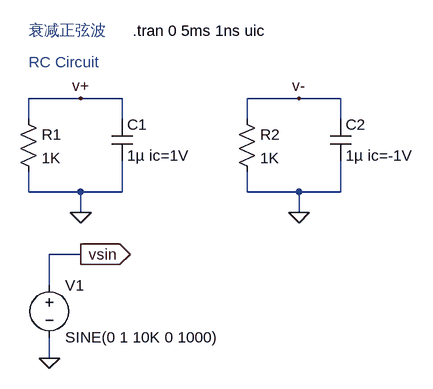
[diagram p0: schematic 04_DecadedSINWave.asc]
04_DecadedSINWave.asc, the LTspice schematic file:
Version 4
SHEET 1 880 680
WIRE 96 144 16 144
WIRE 160 144 96 144
WIRE 432 144 352 144
WIRE 496 144 432 144
WIRE 16 176 16 144
WIRE 160 176 160 144
WIRE 352 176 352 144
WIRE 496 176 496 144
WIRE 16 288 16 256
WIRE 96 288 16 288
WIRE 160 288 160 240
WIRE 160 288 96 288
WIRE 352 288 352 256
WIRE 432 288 352 288
WIRE 496 288 496 240
WIRE 496 288 432 288
WIRE 96 320 96 288
WIRE 432 320 432 288
WIRE 96 384 48 384
WIRE 48 432 48 384
WIRE 48 544 48 512
FLAG 96 320 0
FLAG 96 144 v+
FLAG 432 144 v-
FLAG 432 320 0
FLAG 48 544 0
FLAG 96 384 vsin
IOPIN 96 384 Out
SYMBOL Cap 144 176 R0
SYMATTR InstName C1
SYMATTR Value 1µ ic=1V
SYMBOL Res 0 160 R0
SYMATTR InstName R1
SYMATTR Value 1K
SYMBOL Cap 480 176 R0
SYMATTR InstName C2
SYMATTR Value 1µ ic=-1V
SYMBOL Res 336 160 R0
SYMATTR InstName R2
SYMATTR Value 1K
SYMBOL Voltage 48 416 R0
SYMATTR InstName V1
SYMATTR Value SINE(0 1 10K 0 1000)
TEXT 16 40 Left 2 ;衰减正弦波
TEXT 176 40 Left 2 !.tran 0 5ms 1ns uic
TEXT 16 88 Left 2 ;RC Circuit

The netlist it stands for:
* 04_DecadedSINWave.asc
C1 v+ 0 1µ ic=1V
R1 v+ 0 1K
C2 v- 0 1µ ic=-1V
R2 v- 0 1K
V1 vsin 0 SINE(0 1 10K 0 1000)
* 衰减正弦波
.tran 0 5ms 1ns uic
* RC Circuit
.backanno
.end